# EAGLE design card (EAGLE 8.4.1)
REVISION: 1; SCH_DESC: Standalone Magnetic card reader for Apiary; TEAM: Apiary; TITLE: Apiary Card Reader

## Sheet 1 of 2: Logic
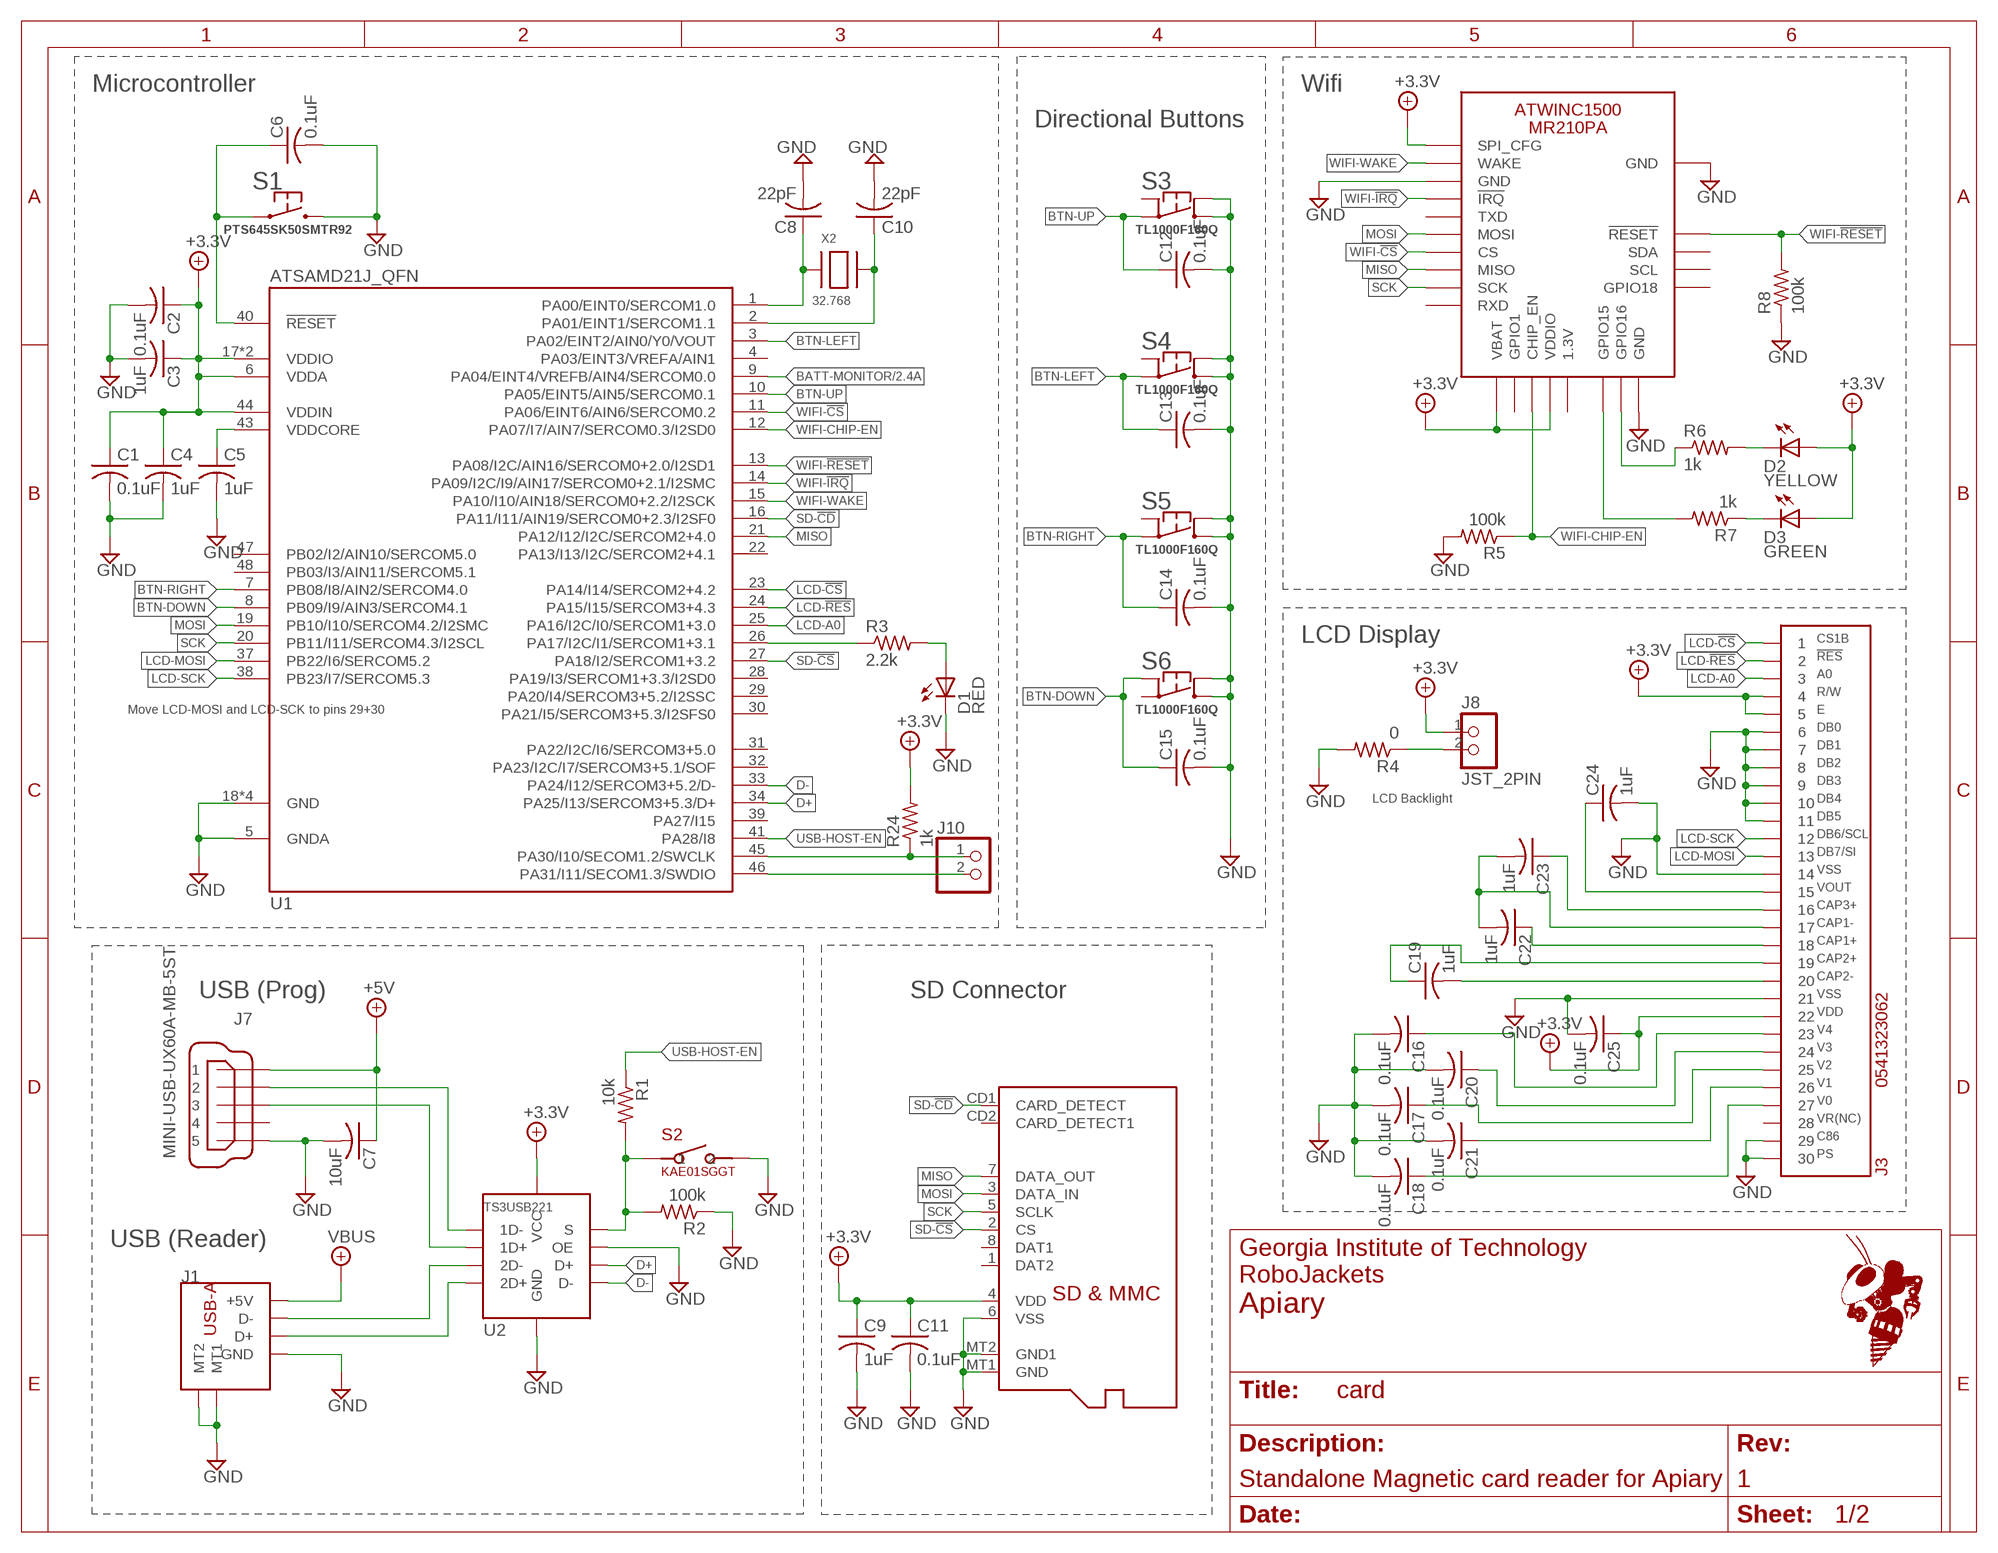
[diagram p0: schematic, sheet 1]

### Parts
C1  0.1uF  C-USC0603  [C0603]
C2  0.1uF  C-USC0603  [C0603]
C3  1uF  C-USC0603  [C0603]
C4  1uF  C-USC0603  [C0603]
C5  1uF  C-USC0603  [C0603]
C6  0.1uF  C-USC0603  [C0603]
C7  10uF  C-USC0603  [C0603]
C8  22pF  C-USC0603  [C0603]
C9  1uF  C-USC0603  [C0603]
C10  22pF  C-USC0603  [C0603]
C11  0.1uF  C-USC0603  [C0603]
C12  0.1uF  C-USC0603  [C0603]
C13  0.1uF  C-USC0603  [C0603]
C14  0.1uF  C-USC0603  [C0603]
C15  0.1uF  C-USC0603  [C0603]
C16  0.1uF  C-USC0603  [C0603]
C17  0.1uF  C-USC0603  [C0603]
C18  0.1uF  C-USC0603  [C0603]
C19  1uF  C-USC0603  [C0603]
C20  0.1uF  C-USC0603  [C0603]
C21  0.1uF  C-USC0603  [C0603]
C22  1uF  C-USC0603  [C0603]
C23  1uF  C-USC0603  [C0603]
C24  1uF  C-USC0603  [C0603]
C25  0.1uF  C-USC0603  [C0603]
D1  RED  LED-SMD-RED  [CHIP-LED0603]
D2  YELLOW  LED-SMD-YELLOW  [CHIP-LED0603]
D3  GREEN  LED-SMD-GREEN  [CHIP-LED0603]
J1  UE27AC54100  [USB-A]
J2  MICROSD  [MICROSD]
J3  0541323062  [0541323062]
J7  MINI-USB-UX60A-MB-5ST  [UX60A-MB-5ST]
J8  JST_2PIN  [JSTPH2]
J10  CONN-2VERT  [1X2]
R1  10k  R-US_R0603  [R0603]
R2  100k  R-US_R0603  [R0603]
R3  2.2k  R-US_R0603  [R0603]
R4  0  R-US_R0603  [R0603]
R5  100k  R-US_R0603  [R0603]
R6  1k  R-US_R0603  [R0603]
R7  1k  R-US_R0603  [R0603]
R8  100k  R-US_R0603  [R0603]
R24  1k  R-US_R0603  [R0603]
S1  PTS645SK50SMTR92  [PTS645SK50SMTR92]
S2  KAE01SGGT  [KAE01SGGT]
S3  TL1000F160Q  [TL1100]
S4  TL1000F160Q  [TL1100]
S5  TL1000F160Q  [TL1100]
S6  TL1000F160Q  [TL1100]
U1  ATSAMD21J_QFN  [TQFN48_7MM]
U2  TS3USB221  [10-PIN-UQFN]
X2  32.768  XTAL-3.2X1.5  [XTAL3215]
X3  ATWINC1500_MR210PA  [ATWINC1500_MR210PA]

### Nets
1D+: J7.3 U2.1(1D+)
1D-: J7.2 U2.2(1D-)
2D+: J1.3(D+) U2.3(2D+)
2D-: J1.2(D-) U2.4(2D-)
!RESET: C6.1 S1.1 S1.2 U1.40(!RESET)
+3.3V: C1.1 C2.1 C3.1 C4.1 C9.1 C11.1 C25.1 D2.A D3.A J2.4(VDD) J3.4 J3.5 J3.22 J8.1 R24.2 U1.6(VDDA) U1.17(VDDIO) U1.36(VDDIO) U1.44(VDDIN) U2.10(VCC) X3.J10(SPI_CFG) X3.J20(VBAT) X3.J23(VDDIO) ; also sheet 2
+5V: C7.1 J7.1 ; also sheet 2
BATT-MONITOR: U1.9(PA04/EINT4/VREFB/AIN4/SERCOM0.0) ; also sheet 2
BTN-DOWN: C15.1 S6.2(1B) U1.8(PB09/I9/AIN3/SERCOM4.1)
BTN-LEFT: C13.1 S4.1(1A) U1.3(PA02/EINT2/AIN0/Y0/VOUT)
BTN-RIGHT: C14.1 S5.1(1A) U1.7(PB08/I8/AIN2/SERCOM4.0)
BTN-UP: C12.1 S3.1(1A) U1.10(PA05/EINT5/AIN5/SERCOM0.1)
D+: U1.34(PA25/I13/SERCOM3+5.3/D+) U2.8(D+)
D-: U1.33(PA24/I12/SERCOM3+5.2/D-) U2.7(D-)
GND: C1.2 C2.2 C3.2 C4.2 C5.2 C6.2 C7.2 C8.2 C9.2 C10.2 C11.2 C12.2 C13.2 C14.2 C15.2 C16.2 C17.2 C18.2 C20.2 C21.2 C24.2 C25.2 D1.C(K) J1.4(GND) J1.MT1 J1.MT2 J2.6(VSS) J2.MT1(GND) J2.MT2(GND1) J3.6 J3.7 J3.8 J3.9 J3.10 J3.11 J3.14 J3.21 J3.29 J3.30 J7.5 R2.1 R4.2 R5.2 R8.1 S1.3 S1.4 S2.2 S3.3(2A) S3.4(2B) S4.3(2A) S4.4(2B) S5.3(2A) S5.4(2B) S6.3(2A) S6.4(2B) U1.5(GNDA) U1.18(GND) U1.35(GND) U1.42(GND) U1.THERMAL(GND) U2.5(GND) U2.6(OE) X3.J9(GND) X3.J12(GND) X3.J28(GND) ; also sheet 2
LCD-!CS: J3.1 U1.23(PA14/I14/SERCOM2+4.2)
LCD-!RES: J3.2 U1.24(PA15/I15/SERCOM3+4.3)
LCD-A0: J3.3 U1.25(PA16/I2C/I0/SERCOM1+3.0)
LCD-CA1+: C22.1 J3.18
LCD-CA1-: C22.2 C23.2 J3.17
LCD-CA2+: C19.1 J3.19
LCD-CA2-: C19.2 J3.20
LCD-CA3+: C23.1 J3.16
LCD-K: J8.2 R4.1
LCD-MOSI: J3.13 U1.37(PB22/I6/SERCOM5.2)
LCD-SCK: J3.12 U1.38(PB23/I7/SERCOM5.3)
LCD-V0: C18.1 J3.27
LCD-V1: C21.1 J3.26
LCD-V2: C17.1 J3.25
LCD-V3: C20.1 J3.24
LCD-V4: C16.1 J3.23
LCD-VOUT: C24.1 J3.15
MISO: J2.7(DATA_OUT) U1.21(PA12/I12/I2C/SERCOM2+4.0) X3.J17(MISO)
MOSI: J2.3(DATA_IN) U1.19(PB10/I10/SERCOM4.2/I2SMC) X3.J15(MOSI)
PROG-LED: D1.A R3.2
PROG-LED-2: R3.1 U1.26(PA17/I2C/I1/SERCOM1+3.1)
SCK: J2.5(SCLK) U1.20(PB11/I11/SERCOM4.3/I2SCL) X3.J18(SCK)
SD-!CD: J2.CD1(CARD_DETECT) U1.16(PA11/I11/AIN19/SERCOM0+2.3/I2SF0)
SD-!CS: J2.2(CS) U1.27(PA18/I2/SERCOM1+3.2)
SWCLK: J10.1 R24.1 U1.45(PA30/I10/SECOM1.2/SWCLK)
SWDIO: J10.2 U1.46(PA31/I11/SECOM1.3/SWDIO)
USB-HOST-EN: R1.1 U1.41(PA28/I8)
USB-S: R1.2 R2.2 S2.1 U2.9(S)
VBUS: J1.1(+5V) ; also sheet 2
VDDCORE: C5.1 U1.43(VDDCORE)
WIFI-!CS: U1.11(PA06/EINT6/AIN6/SERCOM0.2) X3.J16(CS)
WIFI-!IRQ: U1.14(PA09/I2C/I9/AIN17/SERCOM0+2.1/I2SMC) X3.J13(!IRQ)
WIFI-!RESET: R8.2 U1.13(PA08/I2C/AIN16/SERCOM0+2.0/I2SD1) X3.J4(!RESET)
WIFI-CHIP-EN: R5.1 U1.12(PA07/I7/AIN7/SERCOM0.3/I2SD0) X3.J22(CHIP_EN)
WIFI-GPIO15: R7.2 X3.J26(GPIO15)
WIFI-GPIO16: R6.1 X3.J27(GPIO16)
WIFI-LED-G: D3.C(K) R7.1
WIFI-LED-Y: D2.C(K) R6.2
WIFI-WAKE: U1.15(PA10/I10/AIN18/SERCOM0+2.2/I2SCK) X3.J11(WAKE)
X3-1: C8.1 U1.1(PA00/EINT0/SERCOM1.0) X2.P$1
X3-2: C10.1 U1.2(PA01/EINT1/SERCOM1.1) X2.P$2
Unconnected: J2.1(DAT2) J2.8(DAT1) J2.CD2(CARD_DETECT1) J3.28 J7.4 S3.2(1B) S4.2(1B) S5.2(1B) S6.1(1A) U1.4(PA03/EINT3/VREFA/AIN1) U1.22(PA13/I13/I2C/SERCOM2+4.1) U1.28(PA19/I3/SERCOM1+3.3/I2SD0) U1.29(PA20/I4/SERCOM3+5.2/I2SSC) U1.30(PA21/I5/SERCOM3+5.3/I2SFS0) U1.31(PA22/I2C/I6/SERCOM3+5.0) U1.32(PA23/I2C/I7/SERCOM3+5.1/SOF) U1.39(PA27/I15) U1.47(PB02/I2/AIN10/SERCOM5.0) U1.48(PB03/I3/AIN11/SERCOM5.1) X3.J1(GPIO18) X3.J2(SCL) X3.J3(SDA) X3.J14(TXD) X3.J19(RXD) X3.J21(GPIO1) X3.J24(1.3V)

### Notes on the sheet
- Microcontroller | Wifi
- Directional Buttons
- LCD Display | CS1B
- !RES
- A0
- R/W
- Move LCD-MOSI and LCD-SCK to pins 29+30 | E
- DB0
- DB1
- DB2
- DB3
- LCD Backlight | DB4
- DB5
- DB6/SCL
- DB7/SI
- VSS
- VOUT
- CAP3+
- CAP1-
- CAP1+
- CAP2+
- CAP2-
- USB (Prog) | SD Connector | VSS
- VDD
- V4
- V3
- V2
- V1
- V0
- VR(NC)
- C86
- PS
- USB (Reader)

## Sheet 2 of 2: Power
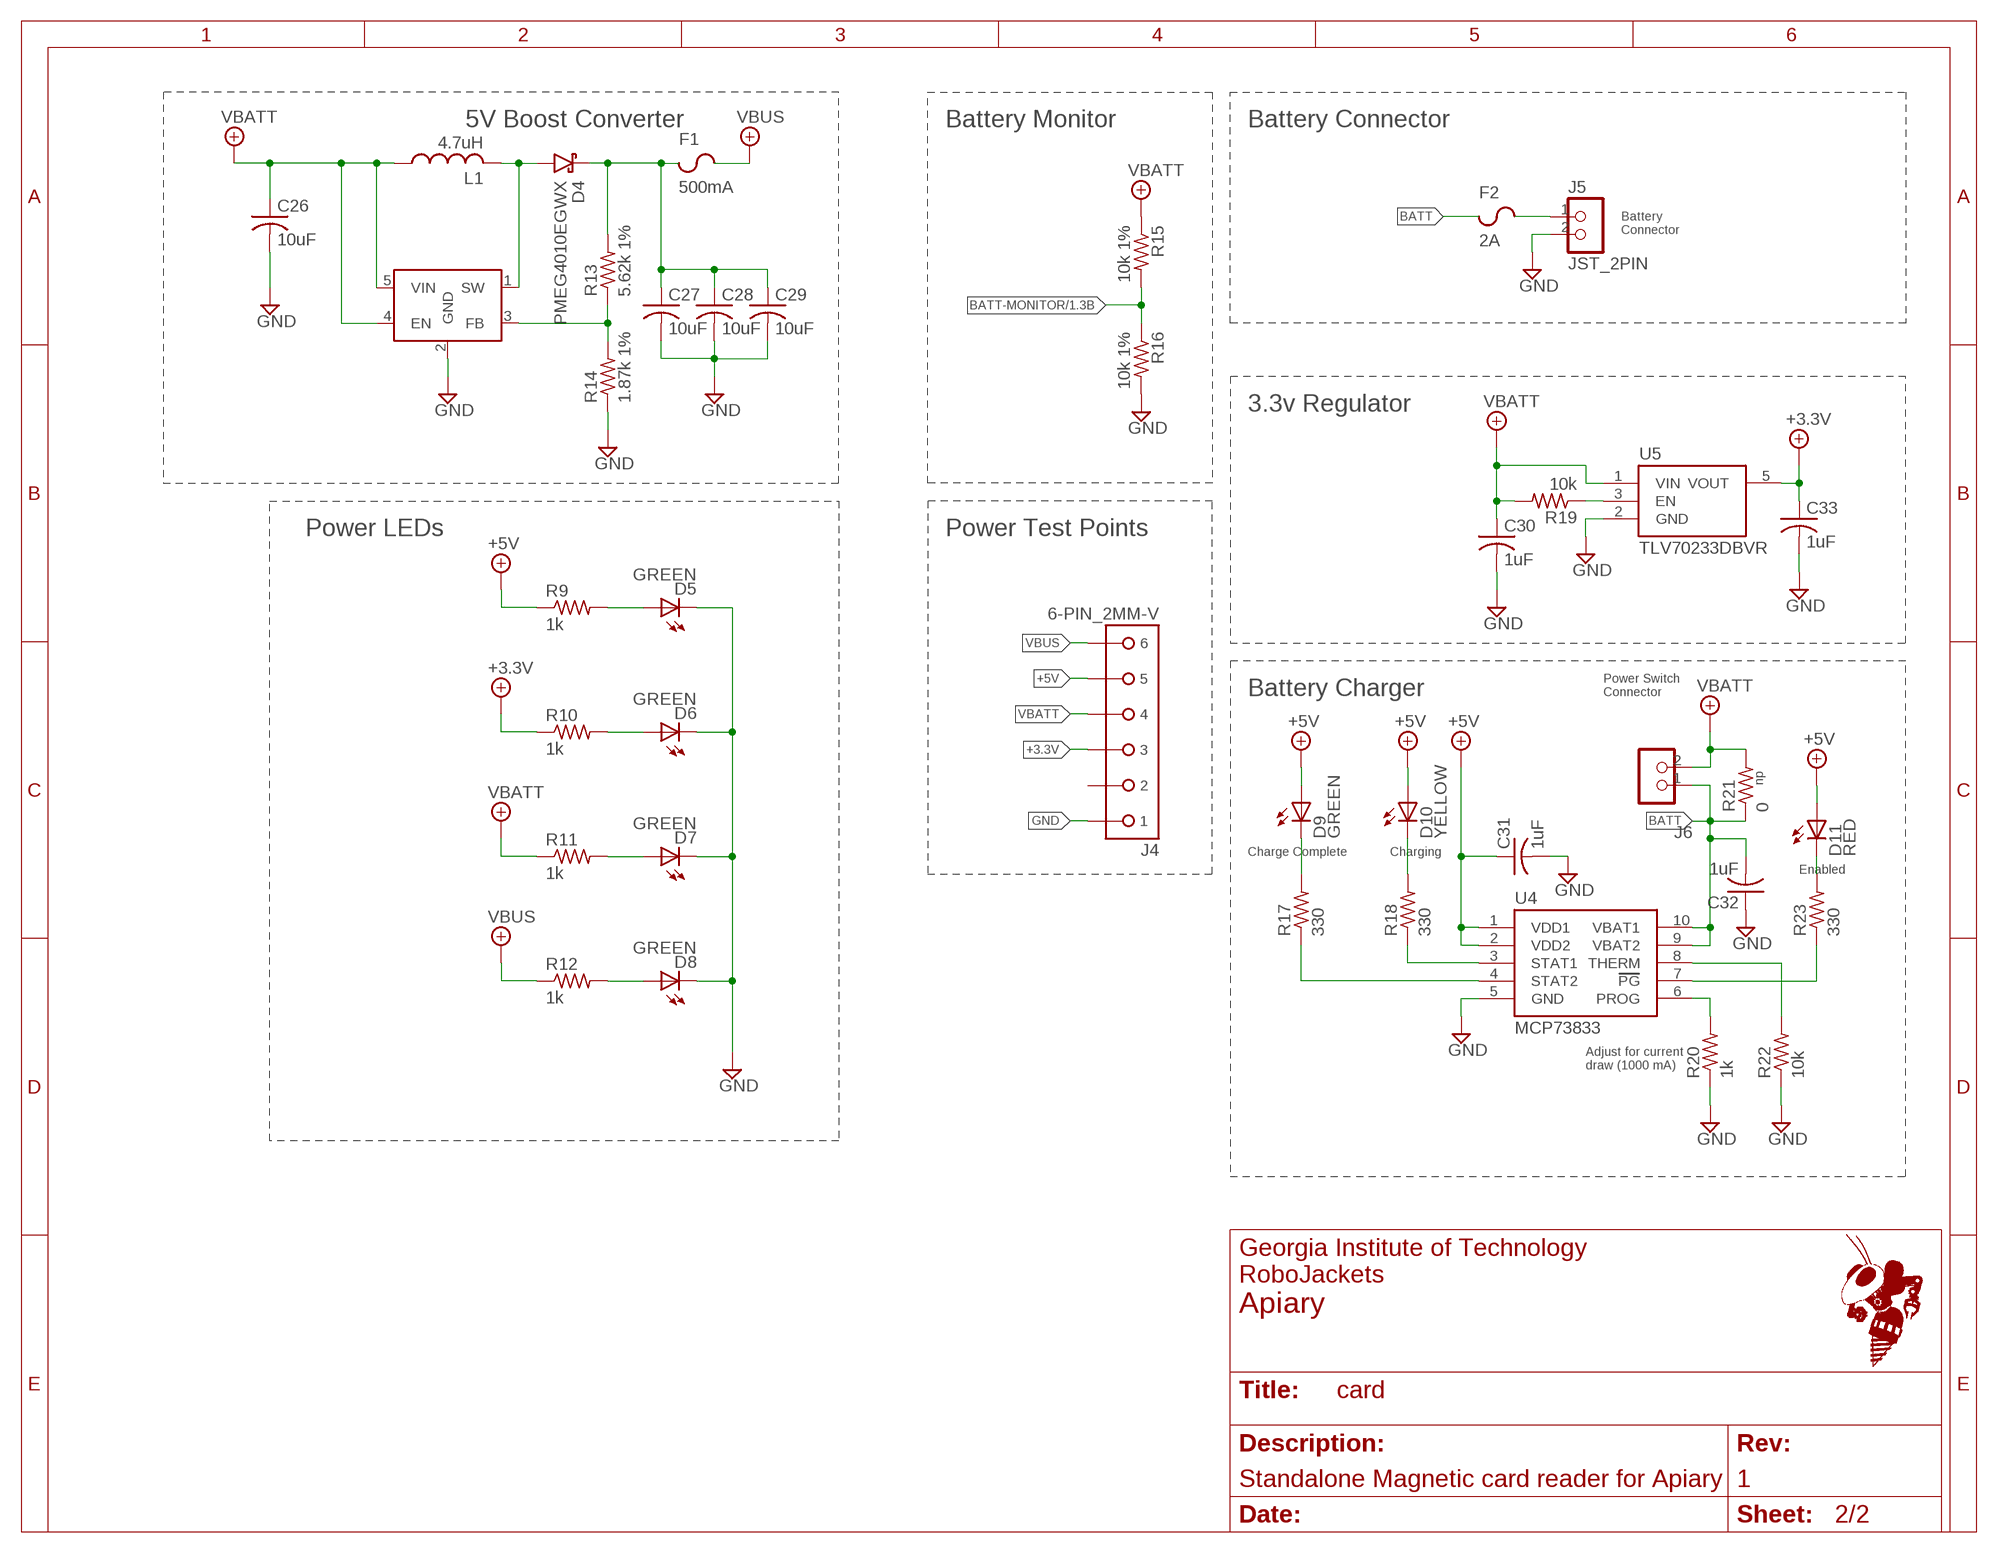
[diagram p1: schematic, sheet 2]

### Parts
C26  10uF  C-USC0603  [C0603]
C27  10uF  C-USC0603  [C0603]
C28  10uF  C-USC0603  [C0603]
C29  10uF  C-USC0603  [C0603]
C30  1uF  C-USC0603  [C0603]
C31  1uF  C-USC0603  [C0603]
C32  1uF  C-USC0603  [C0603]
C33  1uF  C-USC0603  [C0603]
D4  PMEG4010EGWX  SCHOTTKEY-DIODE-SOD123  [SOD123]
D5  GREEN  LED-SMD-GREEN  [CHIP-LED0603]
D6  GREEN  LED-SMD-GREEN  [CHIP-LED0603]
D7  GREEN  LED-SMD-GREEN  [CHIP-LED0603]
D8  GREEN  LED-SMD-GREEN  [CHIP-LED0603]
D9  GREEN  LED-SMD-GREEN  [CHIP-LED0603]
D10  YELLOW  LED-SMD-YELLOW  [CHIP-LED0603]
D11  RED  LED-SMD-RED  [CHIP-LED0603]
F1  500mA  CHIP_FUSE0603  [F0603]
F2  2A  CHIP_FUSE0603  [F0603]
J4  6-PIN_2MM-V  [2MM-6-V]
J5  JST_2PIN  [JSTPH2]
J6  JST_2PIN  [JSTPH2]
L1  4.7uH  L-US-0805  [L0805]
R9  1k  R-US_R0603  [R0603]
R10  1k  R-US_R0603  [R0603]
R11  1k  R-US_R0603  [R0603]
R12  1k  R-US_R0603  [R0603]
R13  5.62k 1%  R-US_R0603  [R0603]
R14  1.87k 1%  R-US_R0603  [R0603]
R15  10k 1%  R-US_R0603  [R0603]
R16  10k 1%  R-US_R0603  [R0603]
R17  330  R-US_R0603  [R0603]
R18  330  R-US_R0603  [R0603]
R19  10k  R-US_R0603  [R0603]
R20  1k  R-US_R0603  [R0603]
R21  0  R-US_R0603  [R0603]
R22  10k  R-US_R0603  [R0603]
R23  330  R-US_R0603  [R0603]
U3  MIC2288YD5-TR  [TSOT-23-5]
U4  MCP73833  [MSOP10]
U5  TLV70233DBVR  [SOT-23-5]

### Nets
3V3_EN: R19.1 U5.3(EN)
+3.3V: C33.1 J4.3 R10.1 U5.5(VOUT) ; also sheet 1
+5V: C31.1 D9.A D10.A D11.A J4.5 R9.1 U4.1(VDD1) U4.2(VDD2) ; also sheet 1
BATT: C32.2 F2.1 J6.1 R21.1 U4.9(VBAT2) U4.10(VBAT1)
BATT-MONITOR: R15.2 R16.1 ; also sheet 1
BATT-PRE-FUSE: F2.2 J5.1
BOOST_FB: R13.1 R14.2 U3.3(FB)
BOOST_OUTPUT: C27.1 C28.1 C29.1 D4.C F1.1 R13.2
BOOST_SW: D4.A L1.2 U3.1(SW)
CHRG-!PG: R23.1 U4.7(PG)
CHRG-PROG: R20.2 U4.6(PROG)
CHRG-STAT1: R18.1 U4.3(STAT1)
CHRG-STAT2: R17.1 U4.4(STAT2)
CHRG-THERM: R22.2 U4.8(THERM)
GND: C26.2 C27.2 C28.2 C29.2 C30.2 C31.2 C32.1 C33.2 D5.C(K) D6.C(K) D7.C(K) D8.C(K) J4.1 J5.2 R14.1 R16.2 R20.1 R22.1 U3.2(GND) U4.5(GND) U5.2(GND) ; also sheet 1
LED-3V3: D6.A R10.2
LED-5V: D8.A R12.2
LED-!PG: D11.C(K) R23.2
LED-STAT1: D10.C(K) R18.2
LED-STAT2: D9.C(K) R17.2
LED-VBATT: D7.A R11.2
LED-VBUS: D5.A R9.2
VBATT: C26.1 C30.1 J4.4 J6.2 L1.1 R11.1 R15.1 R19.2 R21.2 U3.4(EN) U3.5(VIN) U5.1(VIN)
VBUS: F1.2 J4.6 R12.1 ; also sheet 1
Unconnected: J4.2

### Notes on the sheet
- 5V Boost Converter | Battery Monitor | Battery Connector
- Battery
  Connector
- 3.3v Regulator
- Power LEDs | Power Test Points
- Battery Charger
- Power Switch
  Connector
- np
- Charge Complete | Charging
- Enabled
- Adjust for current 
  draw (1000 mA)

## Library data of the parts
C1-C6 C8-C33 = rcl:C-US: CAPACITOR, American symbol
C7 = card:C-US: CAPACITOR, American symbol
D1 D11 = RoboJackets-LEDs:LED-SMD; DIGIKEY: 160-1447-1-ND; MPN: LTST-C191KRKT
D2 D10 = RoboJackets-LEDs:LED-SMD; DIGIKEY: 160-1448-1-ND; MPN: LTST-C191KSKT
D3 D5-D9 = RoboJackets-LEDs:LED-SMD; DIGIKEY: 160-1446-1-ND; MPN: LTST-C191KGKT
D4 = CardReader:SCHOTTKEY-DIODE-
F1 F2 = RoboJackets-Fuses:CHIP_FUSE
J1 = CardReader:UE27AC54100
J2 = CardReader:MICROSD: Micro-SD / Transflash card holder with SPI pinout For the 3M # 2908-05WB-MG and/or 4UCON #19656 push-push type
J3 = CardReader:0541323062: 30 Position FFC, FPC Connector Contacts, Bottom 0.020" (0.50mm) Surface Mount, Right Angle
J4 = RoboJackets-Connectors:6-PIN_2MM-*; PINS: 6; PIN_PITCH: 2.0 mm
J5 J6 = CardReader:JST_2PIN: JST 2-Pin Right-Angle Connector PH-Series - 4UConnector: 17311 SH-Series - 4UConnector: 07278
J7 = lib-card:MINI-USB-: MINI USB Connector Source: http://www.hirose.co.jp/cataloge_hp/e24000019.pdf; OC_FARNELL: unknown; OC_NEWARK: unknown
J8 = card:JST_2PIN: JST 2-Pin Right-Angle Connector PH-Series - 4UConnector: 17311 SH-Series - 4UConnector: 07278
J10 = RoboJackets-Connectors:CONN-2
L1 = CardReader:L-US
R1-R24 = rcl:R-US_: RESISTOR, American symbol
S1 = CardReader:PTS645SK50SMTR92
S2 = CardReader:KAE01SGGT
S3-S6 = CardReader:TL1000F160Q: Tactile Switch SPST-NO Top Actuated Through Hole
U1 = CardReader:ATSAMD21J
U2 = CardReader:TS3USB221: High Speed USB 2.0 1:2 MUX-DEMUX switch with single enable
U3 = CardReader:MIC2288YD5-TR: Boost Switching Regulator IC Positive Adjustable 2.5V 1 Output 1.2A (Switch) SOT-23-5 Thin, TSOT-23-5; MPN: MIC2288YD5-TR
U4 = CardReader:MCP73833: Lithium-Polymer/Lithium-Ion Battery Charger [Part No.] Microchip MCP73833 MSOP10 (tube only): Digikey: MCP73833T-AMI/UN or MCP73833-FCI/UN-ND Mouser: 579-MCP73833-AMI/UN DFN10 (tape): Digikey: Note Chips ending in 'AMI' have no timer, and chips ending in 'FCI' have a 6-hour timer that will end the charge sequence after 6 horus regqrdless of current charge level.
U5 = lib-card:TLV70233; DIGIKEY: 296-32415-1-ND; MPN: TLV70233DBVR
X2 = lib-card:XTAL: Low cost SMT crystals, no capacitors included http://www.ladyada.net/library/eagle
X3 = CardReader:ATWINC1500_MR210PA: ATWINC1500_MR210PA wifi module

## Board
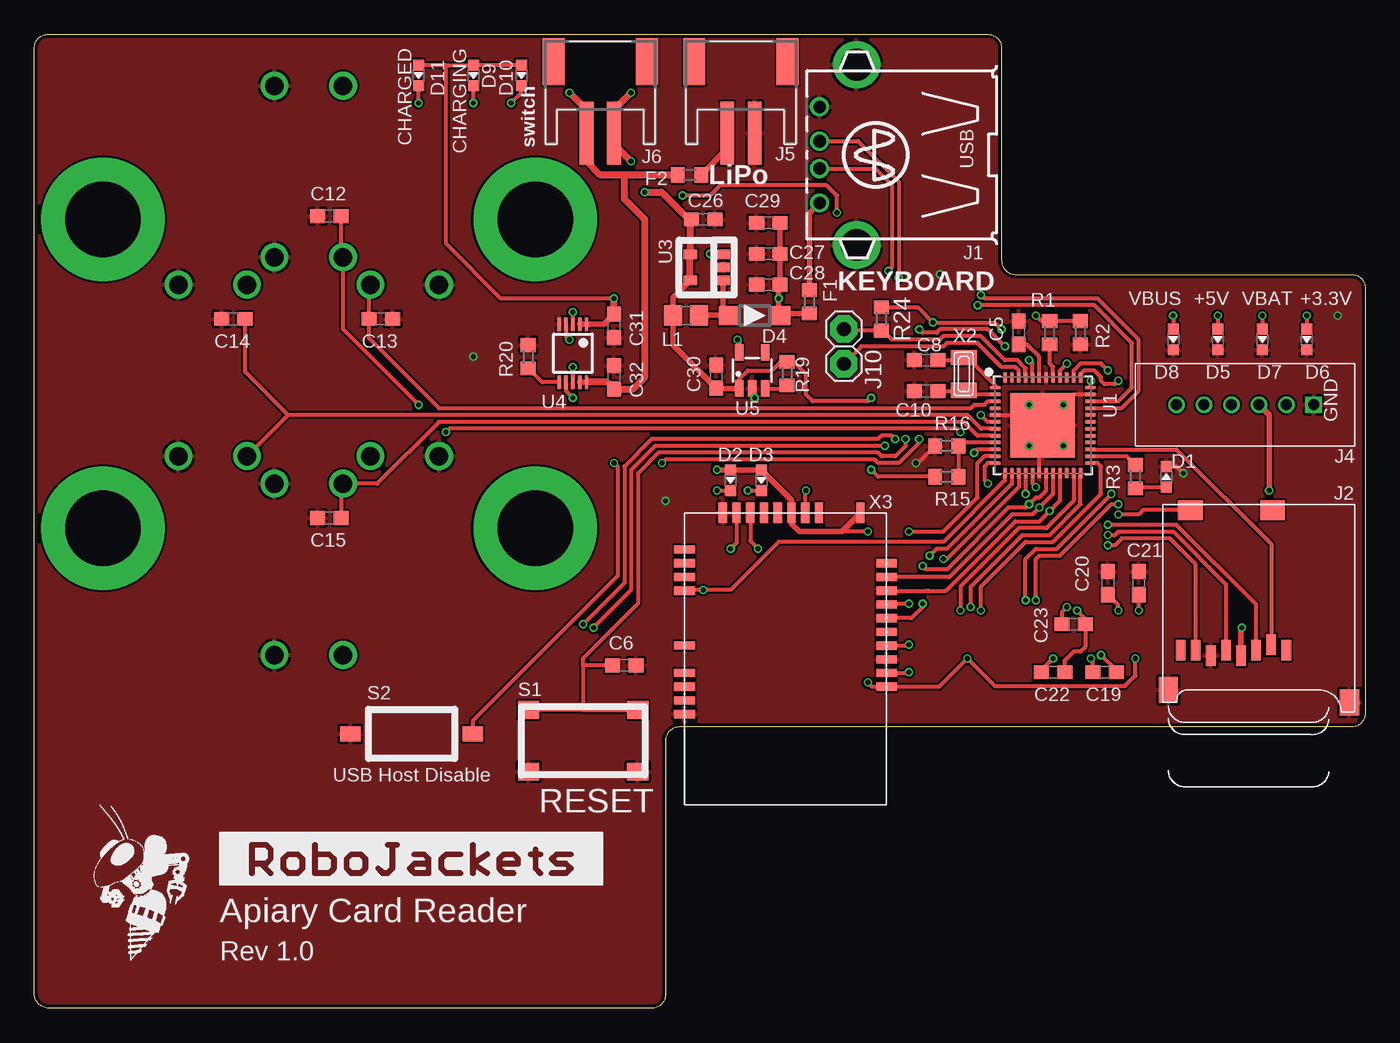
[diagram p2: board, top side]
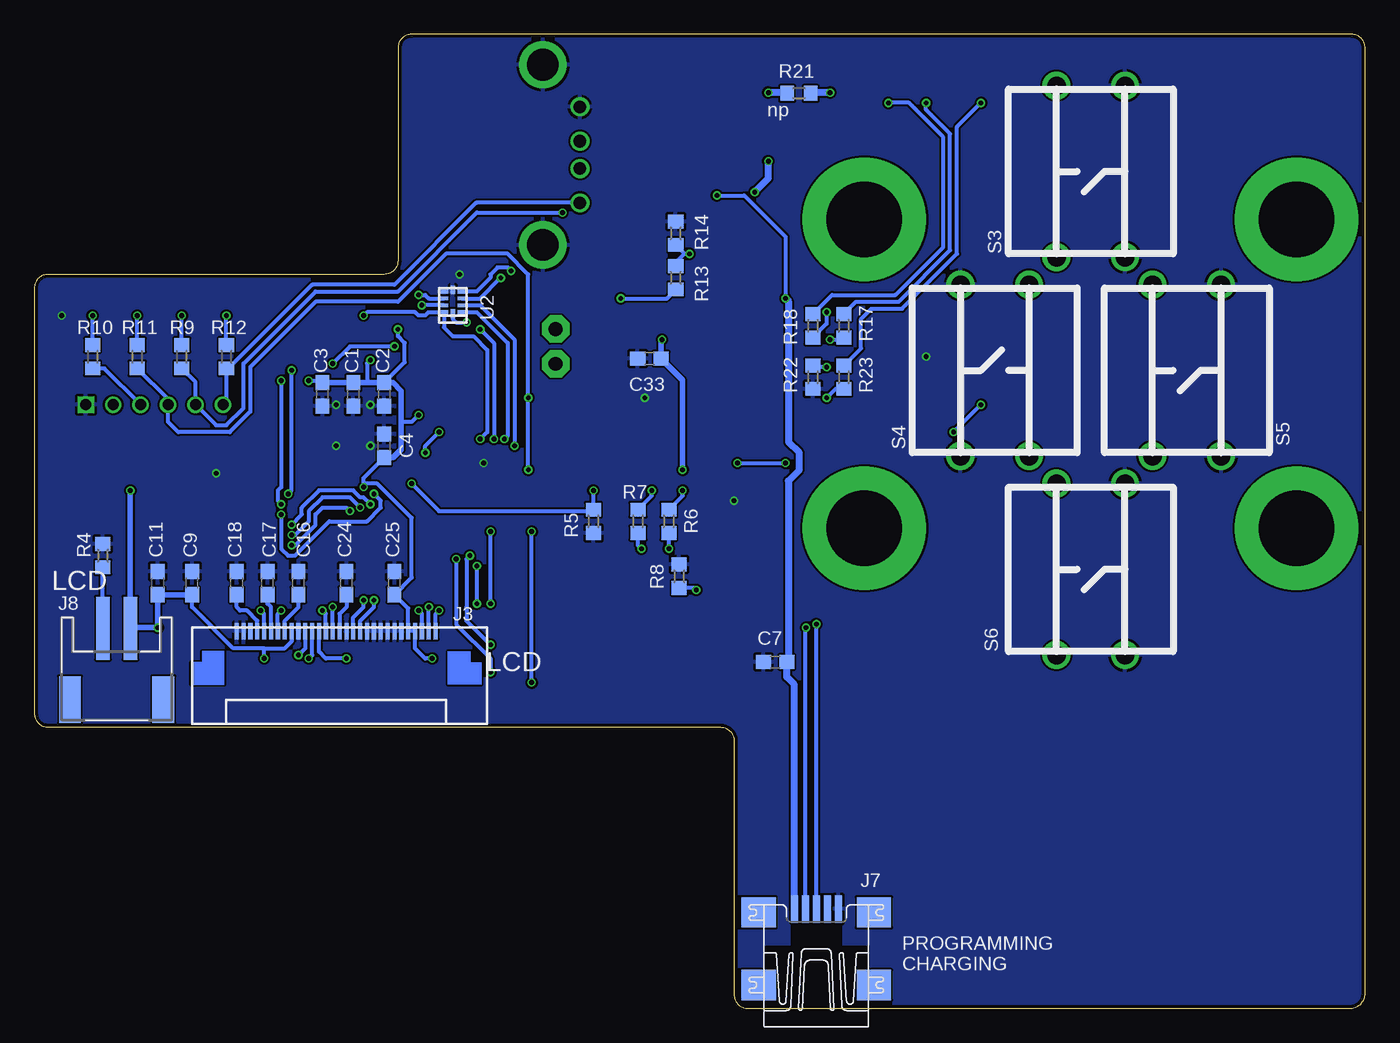
[diagram p3: board, bottom side, seen from below]

Size 97 x 71.01 mm. Coordinates in mm from the lower left corner, seen from the top.
Outline: 97,52.51 97,21.51 arc-90 96,20.51 47,20.51 arc90 46,19.51 46,1.01 arc-90 45,0.01 1.25,0.01 arc-90 0,1.01 0,70.01 arc-90 1,71.01 69.5,71.01 arc-90 70.5,70.01 70.5,54.51 arc90 71.5,53.51 96,53.51 arc-90 97,52.51
Copper layers (1*16): Top 0.018mm / dielectric 1.55mm / Bottom 0.018mm
Design rules "eC_2Layer_PClass6_BaseCopperO18_eCDefault": minimum track width 0.15mm, minimum drill 0.35mm, track to track 0.15mm, track to pad 0.15mm, pad to pad 0.15mm, via to via 0.15mm, smd to smd 0mil, copper to edge 0.25mm, drill to drill 0.35mm, minimum pad ring 0.175mm, minimum via ring 0.125mm, stop-mask expansion 0mil, vias tented up to drill 0.45mm, thermal gap 0.2mm

### Footprints (pad centres in the part's own frame; a part is rotated, then mirrored left to right if it is on the bottom)
C0603 = smd 1.1 x 1: 1 -0.85,0; 2 0.85,0
CHIP-LED0603 = smd 0.8 x 0.8: A 0,-0.75; C 0,0.75
SOD123 = smd 1.4 x 1.4: A 1.9,0; C -1.9,0
F0603 = smd 1 x 1.1: 1 -0.85,0; 2 0.85,0
USB-A = drill 0.92: 1 -3.5,12.99; 2 -1,12.99; 3 1,12.99; 4 3.5,12.99 | drill 2.3: MT1 -6.57,10.3; MT2 6.57,10.3
MICROSD = smd 0.7 x 1.5: 1 9,-10.64; 2 7.9,-10.24; 3 6.8,-10.64; 4 5.7,-11.04; 5 4.6,-10.64; 6 3.5,-11.04; 7 2.4,-10.64; 8 1.3,-10.64 | smd 1.8 x 1.4: CD1 2,-0.44; CD2 8,-0.44 | smd 1.4 x 1.9: MT1 0.4,-13.54; MT2 13.6,-14.44
0541323062 = smd 0.3 x 1.2: 1 7.25,1.5; 2 6.75,1.5; 3 6.25,1.5; 4 5.75,1.5; 5 5.25,1.5; 6 4.75,1.5; 7 4.25,1.5; 8 3.75,1.5; 9 3.25,1.5; 10 2.75,1.5; 11 2.25,1.5; 12 1.75,1.5; 13 1.25,1.5; 14 0.75,1.5; 15 0.25,1.5; 16 -0.25,1.5; 17 -0.75,1.5; 18 -1.25,1.5; 19 -1.75,1.5; 20 -2.25,1.5; 21 -2.75,1.5; 22 -3.25,1.5; 23 -3.75,1.5; 24 -4.25,1.5; 25 -4.75,1.5; 26 -5.25,1.5; 27 -5.75,1.5; 28 -6.25,1.5; 29 -6.75,1.5; 30 -7.25,1.5
2MM-6-V = drill 0.8 square: 1 -4,0 | drill 0.8: 2 -2,0; 3 0,0; 4 2,0; 5 4,0; 6 6,0
JSTPH2 = smd 1 x 4.6: 1 -1,-3.7; 2 1,-3.7 | smd 1.6 x 3.4: NC1 -3.4,1.5; NC2 3.4,1.5
UX60A-MB-5ST = smd 2 x 0.5: 1 2.25,1.6; 2 2.25,0.8; 3 2.25,0; 4 2.25,-0.8; 5 2.25,-1.6 | smd 2.2 x 2.5: M1 -3.3,-4.2; M2 -3.3,4.2; M3 2,4.2; M4 2,-4.2
1X2 = drill 1.016 pad 2 octagon: 1 -1.27,0; 2 1.27,0
L0805 = smd 1.3 x 1.5: 1 -0.95,0; 2 0.95,0
R0603 = smd 1 x 1.1: 1 -0.85,0; 2 0.85,0
PTS645SK50SMTR92 = smd 1.55 x 1.3: 1 -3.975,2.25; 2 3.975,2.25; 3 -3.975,-2.25; 4 3.975,-2.25
KAE01SGGT = smd 1.1 x 1.5: 1 0,-4.45; 2 0,4.45
TL1100 = drill 1.35: 1 -6.25,2.5; 2 6.25,2.5; 3 -6.25,-2.5; 4 6.25,-2.5
TQFN48_7MM = smd 0.25 x 0.75: 1 -2.75,-3.475; 2 -2.25,-3.475; 3 -1.75,-3.475; 4 -1.25,-3.475; 5 -0.75,-3.475; 6 -0.25,-3.475; 7 0.25,-3.475; 8 0.75,-3.475; 9 1.25,-3.475; 10 1.75,-3.475; 11 2.25,-3.475; 12 2.75,-3.475; 25 2.75,3.475; 26 2.25,3.475; 27 1.75,3.475; 28 1.25,3.475; 29 0.75,3.475; 30 0.25,3.475; 31 -0.25,3.475; 32 -0.75,3.475; 33 -1.25,3.475; 34 -1.75,3.475; 35 -2.25,3.475; 36 -2.75,3.475 | smd 0.75 x 0.25: 13 3.475,-2.75; 14 3.475,-2.25; 15 3.475,-1.75; 16 3.475,-1.25; 17 3.475,-0.75; 18 3.475,-0.25; 19 3.475,0.25; 20 3.475,0.75; 21 3.475,1.25; 22 3.475,1.75; 23 3.475,2.25; 24 3.475,2.75; 37 -3.475,2.75; 38 -3.475,2.25; 39 -3.475,1.75; 40 -3.475,1.25; 41 -3.475,0.75; 42 -3.475,0.25; 43 -3.475,-0.25; 44 -3.475,-0.75; 45 -3.475,-1.25; 46 -3.475,-1.75; 47 -3.475,-2.25; 48 -3.475,-2.75 | smd 4.7 x 4.7: THERMAL 0,0
10-PIN-UQFN = smd 0.3 x 0.58: 1 -0.75,-0.635; 4 0.75,-0.635; 6 0.75,0.635; 9 -0.75,0.635 | smd 0.25 x 0.58: 2 -0.25,-0.635; 3 0.25,-0.635; 7 0.25,0.635; 8 -0.25,0.635 | smd 0.63 x 0.35: 5 0.86,0; 10 -0.86,0
TSOT-23-5 = smd 0.7 x 1: 1 0.95,1.2; 2 0,1.2; 3 -0.95,1.2; 4 -0.95,-1.2; 5 0.95,-1.2
MSOP10 = smd 0.25 x 1: 1 -1,-2.113; 2 -0.5,-2.113; 3 0,-2.113; 4 0.5,-2.113; 5 1,-2.113; 6 1,2.113; 7 0.5,2.113; 8 0,2.113; 9 -0.5,2.113; 10 -1,2.113
SOT-23-5 = smd 0.6 x 1.2: 1 -0.95,-1.306; 2 0,-1.306; 3 0.95,-1.306; 4 0.95,1.306; 5 -0.95,1.306
XTAL3215 = smd 1.1 x 1.9: P$1 1.2,0; P$2 -1.2,0
ATWINC1500_MR210PA = smd 1.5 x 0.6: J1 7.11,-4.95; J2 7.11,-3.95; J3 7.11,-2.95; J4 7.11,-1.95; J5 7.11,2.05; J6 7.11,4.05; J7 7.11,5.05; J8 7.11,6.05; J9 7.11,7.05; J10 -7.62,5.06; J11 -7.62,4.06; J12 -7.62,3.06; J13 -7.62,2.06; J14 -7.62,1.06; J15 -7.62,0.06; J16 -7.62,-0.94; J17 -7.62,-1.94; J18 -7.62,-2.94; J19 -7.62,-3.94 | smd 0.6 x 1.5: J20 -5.72,-7.62; J21 -2.68,-7.62; J22 -1.68,-7.62; J23 -0.68,-7.62; J24 0.32,-7.62; J25 1.32,-7.62; J26 2.32,-7.62; J27 3.32,-7.62; J28 4.32,-7.62

### Placement (x,y rotation side)
C1  73.75,44.76 270 bottom
C2  71.5,44.76 270 bottom
C3  76,44.76 270 bottom
C4  71.5,41.01 90 bottom
C5  71.75,49.26 90 top
C6  43,25.01 0 top
C7  43,25.26 180 bottom
C8  65,47.26 180 top
C9  85.5,31.01 90 bottom
C10  65,45.01 180 top
C11  88,31.01 90 bottom
C12  21.5,57.76 180 top
C13  25.25,50.26 0 top
C14  14.5,50.26 180 top
C15  21.5,35.76 180 top
C16  77.75,31.01 90 bottom
C17  80,31.01 90 bottom
C18  82.25,31.01 90 bottom
C19  78,24.51 0 top
C20  78.25,31.01 90 top
C21  80.5,31.01 90 top
C22  74.25,24.51 0 top
C23  75.75,28.01 0 top
C24  74.25,31.01 90 bottom
C25  70.75,31.01 90 bottom
C26  48.75,57.51 0 top
C27  53.5,55.01 180 top
C28  53.5,52.76 180 top
C29  53.5,57.26 180 top
C30  49.7,46.06 90 top
C31  42.25,49.76 270 top
C32  42.25,46.01 270 top
C33  52.17,47.38 180 bottom
D1  82.5,38.76 0 top
D2  50.75,38.51 180 top
D3  53,38.51 180 top
D4  52.5,50.51 180 top
D5  86.25,48.76 180 top
D6  92.75,48.76 180 top
D7  89.5,48.76 180 top
D8  83,48.76 180 top
D9  32,68.01 180 top
D10  35.5,68.01 180 top
D11  28,68.01 180 top
F1  56.5,51.51 90 top
F2  47.75,60.76 0 top
J1  70.23,62.22 90 top
J2  82.25,36.76 0 top
J3  75,26.01 0 bottom
J4  89.25,44.01 180 top
J5  51.5,67.51 0 top
J6  41.25,67.51 0 top
J7  40,5.01 90 bottom
J8  91,24.01 180 bottom
J10  59,48.26 270 top
L1  47.5,50.51 0 top
R1  74,49.26 90 top
R2  76.25,49.26 90 top
R3  80.25,38.76 270 top
R4  92,33.01 90 bottom
R5  56.25,35.51 270 bottom
R6  50.75,35.51 90 bottom
R7  53,35.51 270 bottom
R8  50,31.51 270 bottom
R9  86.25,47.51 90 bottom
R10  92.75,47.51 90 bottom
R11  89.5,47.51 90 bottom
R12  83,47.51 90 bottom
R13  50.25,53.26 270 bottom
R14  50.25,56.51 270 bottom
R15  66.5,38.76 0 top
R16  66.5,41.01 180 top
R17  38,49.76 90 bottom
R18  40.25,49.76 90 bottom
R19  54.87,46.28 90 top
R20  36,47.51 270 top
R21  41.27,66.71 180 bottom
R22  40.25,46.01 90 bottom
R23  38,46.01 90 bottom
R24  61.75,50.26 90 top
S1  40,19.51 0 top
S2  27.5,20.01 90 top
S3  20,61.01 90 bottom
S4  27,46.51 270 bottom
S5  13,46.51 90 bottom
S6  20,32.01 90 bottom
U1  73.5,42.51 270 top
U2  66.5,51.51 90 bottom
U3  49,54.01 270 top
U4  39.25,47.76 180 top
U5  52.32,46.51 0 top
U$1  [ROBOBUZZ_0.6X]  7,3.51 0 top
U$2  [ROBOJACKETS]  13.5,9.01 0 top
X2  67.75,46.26 90 top
X3  54.5,28.51 180 top

### Tracks (layer width: path | path; a pad name or v marks a point on that pad's centre or on a via)
1D+  (via drill 0.35)
  Top 0.3: v62.75,41.51 62.5,41.76 61.75,41.76 61.5,41.51 45,41.51 43,39.51 43,31.01 v40,28.01
  Bottom 0.3: U2.1 64.75,50.76 62.5,48.51 62.5,41.76 v62.75,41.51 | J7.3 v40,28.01
1D-  (via drill 0.35)
  Top 0.3: v40.75,27.76 43.5,30.51 43.5,39.26 45.25,41.01 v62,41.01
  Bottom 0.3: U2.2 64.5,51.26 62,48.76 v62,41.01 | v40.75,27.76 40.8,27.71 J7.2
2D+  (via drill 0.35)
  Top 0.3: v63,53.26 63,60.26 60.04,63.22 J1.3
  Bottom 0.3: U2.3 64.5,51.76 v63,53.26
2D-  (via drill 0.35)
  Top 0.3: J1.2 61.29,61.22 62.5,60.01 62.5,54.01 v62.25,53.76
  Bottom 0.3: v62.25,53.76 62.5,54.01 63.25,54.01 63.75,53.51 63.75,53.26 64.75,52.26 U2.4
3V3_EN
  Top 0.3: U5.3 54.64,45.2 R19.1
!RESET  (via drill 0.35)
  Top 0.3: v70.75,48.26 69.5,49.51 66,49.51 65.75,49.26 64.75,49.26 v64.5,49.51 | v63.5,41.51 63.5,41.01 62.75,40.26 61.75,40.26 61.5,40.51 45.5,40.51 44,39.01 44,29.51 40,25.51 40,25.01 | 40,21.76 S1.1 | 40,21.76 S1.2 | 40,25.01 40,21.76 | C6.1 40,25.01 | U1.40 74.75,46.51 v75.25,47.01
  Bottom 0.3: v64.5,49.51 63.5,48.51 v63.5,41.51 | v70.75,48.26 74,48.26 v75.25,47.01
+3.3V  (via drill 0.35)
  Top 0.3: v60.75,23.76 61.06,23.45 X3.J10 65.94,23.45 v68,25.51 70,23.51 79.5,23.51 80.25,24.26 v80.25,25.51 | v60.75,34.76 58.85,34.76 | v70.5,49.51 70,50.01 v65.5,50.01 64.4,51.11 R24.2 | U1.17 72.75,38.26 v73,38.01 | U1.6 69.5,42.76 v69,43.26 | U1.44 72.75,47.01 v72.5,47.26 | U1.36 76.97,45.73 v77,45.76
  Top 0.4: X3.J20 58.85,34.76 55.75,34.76 55.18,35.33 X3.J23 55.18,37.08 D3.A D2.A v49.75,39.26 | J2.4 87.95,27.71 v88,27.76 | v90,37.76 90,43.26 J4.3 | v51.25,48.76 51.37,48.64 U5.5
  Bottom 0.3: v68,25.51 68.5,25.51 69.25,26.26 J3.4 J3.5 69.75,29.16 C25.1 69.5,31.41 69.5,35.76 72,38.26 73,38.26 | v60.75,23.76 v60.75,34.76 | C2.1 70,47.11 70,48.51 70.5,49.01 v70.5,49.51 | J3.22 78.25,26.76 78.75,26.26 80.25,26.26 | 80.25,26.26 82.5,26.26 85.5,29.26 C9.1 | v80.25,25.51 80.25,26.26 | 73,38.26 v73,38.01 | 73,38.26 73,38.66 C4.1 | v69,43.26 69.5,42.76 70.25,42.76 | v72.5,47.26 72.75,47.01 72.75,45.61 | v77,45.76 76.15,45.76 C3.1 | R10.1 91.9,46.66 J4.3 | U2.10 66.5,50.26 66.25,50.01 v65.5,50.01
  Bottom 0.4: C3.1 C1.1 72.75,45.61 C2.1 70.85,45.61 70.25,45.01 70.25,42.76 70.25,40.76 70.85,40.16 C4.1 | C9.1 C11.1 v88,27.76 89.95,27.76 J8.1 v90,37.76 | v49.75,39.26 49.75,45.81 C33.1 51.32,48.69 v51.25,48.76
+5V  (via drill 0.35)
  Top 0.3: D10.A D9.A 30,68.76 | 30,68.76 D11.A | v42.25,51.76 34,51.76 30,55.76 30,68.76 | v58.5,58.01 58.5,59.26 57.75,60.01 50,60.01 49.25,59.26 v47.25,59.26
  Top 0.4: U4.2 U4.1 41.51,49.87 C31.1
  Top 0.5: C31.1 v42.25,51.76
  Bottom 0.3: v47.25,59.26 45.25,59.26 42.25,56.26 v42.25,51.76 | v58.5,58.01 64.75,58.01 70.5,52.26 76.5,52.26 81.75,47.01 81.75,43.76 83,42.51 83.75,42.51 J4.5 85.25,45.66 R9.1
  Bottom 0.5: J7.1 41.6,23.61 42.15,24.16 C7.1 42.05,25.36 42.05,38.46 41.25,39.26 41.25,40.51 42,41.26 42,51.51 v42.25,51.76
BATT  (via drill 0.35)
  Top 0.3: J6.1 40.25,65.51
  Top 0.4: U4.10 U4.9 | 43,59.01 43.02,59.03
  Top 0.5: U4.10 41.76,45.64 C32.2 43.65,45.16 44.5,46.01 44.5,57.51 43,59.01 | F2.1 43.02,60.76 | 43.02,59.03 43.02,60.76 | 40.25,65.51 v39,66.76 | 43.02,60.76 41.25,60.76 40.25,61.76 J6.1
  Bottom 0.3: 40.37,66.76 R21.1
  Bottom 0.5: v39,66.76 40.37,66.76
BATT-MONITOR
  Top 0.3: R15.2 R16.1 67.6,41.26 U1.9
BATT-PRE-FUSE
  Top 0.4: F2.2 50.5,62.66 J5.1
BOOST_FB  (via drill 0.35)
  Top 0.3: U3.3 49.3,54.96 v49.25,55.01
  Bottom 0.3: 49.6,55.01 v49.25,55.01 | 49.6,55.01 R14.2 | R13.1 50.25,54.36 49.6,55.01
BOOST_OUTPUT  (via drill 0.35)
  Top 0.4: C29.1 C27.1 C28.1 54.25,52.66 v54.25,51.76 54.25,50.66 D4.C 54.55,50.66 F1.1
  Bottom 0.3: v54.25,51.76 50.9,51.76 R13.2
BOOST_SW
  Top 0.4: 50.55,50.56 D4.A | 50.55,50.56 50.2,50.91 U3.1 | L1.2 48.5,50.56 50.55,50.56
BTN-DOWN
  Top 0.3: U1.8 68.75,41.76 67.75,42.76 29.5,42.76 25,38.26 S6.2 22.35,38.11 C15.1
BTN-LEFT
  Top 0.3: S4.1 24.4,52.66 C13.1 24.4,48.86 29.5,43.76 68.25,43.76 68.5,44.01 69.25,44.01 69.5,44.26 U1.3
BTN-RIGHT
  Top 0.3: U1.7 69,42.26 68,43.26 18.5,43.26 | S5.1 18.5,43.26 | 18.5,43.26 15.35,46.41 C14.1
BTN-UP  (via drill 0.35)
  Top 0.3: U1.10 68.75,40.76 v68.5,40.51 | v67.5,42.01 67.25,42.26 30.25,42.26 v30,42.01 | v28,44.01 22.5,49.51 S3.1 22.35,54.91 C12.1
  Bottom 0.3: v68.5,40.51 68.5,41.01 v67.5,42.01 | v30,42.01 v28,44.01
CHRG-!PG  (via drill 0.35)
  Top 0.3: U4.7 38.75,45.01 v39.25,44.51
  Bottom 0.3: v39.25,44.51 38.6,45.16 R23.1
CHRG-PROG
  Top 0.3: U4.6 37.01,45.64 R20.2
CHRG-STAT1  (via drill 0.35)
  Top 0.3: U4.3 v39.25,50.76
  Bottom 0.3: v39.25,50.76 39.25,49.91 R18.1
CHRG-STAT2  (via drill 0.35)
  Top 0.3: U4.4 38.75,49.01 v39,48.76
  Bottom 0.3: v39,48.76 38.15,48.76 R17.1
CHRG-THERM  (via drill 0.35)
  Top 0.3: U4.8 v39.25,46.76
  Bottom 0.3: v39.25,46.76 40.15,46.76 R22.2
D+  (via drill 0.35)
  Top 0.3: U1.34 79,44.26 80,45.26 80,48.51 77.25,51.26 v68.75,51.26
  Bottom 0.3: U2.8 v68.75,51.26
D-  (via drill 0.35)
  Top 0.3: U1.33 79.25,43.76 80.5,45.01 80.5,48.76 77.5,51.76 69.25,51.76 v69,52.01
  Bottom 0.3: v69,52.01 68.5,52.01 68.25,51.76 U2.7
GND  (via drill 0.35)
  Top 0.3: U1.5 71.25,43.26 71.5,43.01 | U1.18 73.25,40.26 73.5,40.51 | U1.35 75.75,44.76 75.5,44.51 | U1.THERMAL 73.5,41.01 v72.5,41.01 | 52.32,45.58 U5.2 52.32,44.69 v52.5,44.51 | R16.2 64.4,39.76 v64.25,39.76 | D1.C 83.25,39.51 v83.75,39.01
  other vias: 72.5,44.01 75,44.01 75,41.01 66,53.51 95,50.51 32,47.51 46,37.01
  pour Bottom: 0,0.01 0,71.01 70.5,71.01 70.5,53.51 97,53.51 97,20.51 46,20.51 46,0.01
  pour Top: 0,0.01 0,71.01 70.5,71.01 70.5,53.51 97,53.51 97,20.51 46,20.51 46,0.01
LCD-!CS  (via drill 0.35)
  Top 0.3: U1.23 75.75,37.01 73.75,35.01 71.75,35.01 67.5,30.76 v67.5,29.01
  Bottom 0.3: J3.1 67.75,28.76 v67.5,29.01
LCD-!RES  (via drill 0.35)
  Top 0.3: v68.25,29.26 68.25,30.76 72,34.51 74,34.51 76.25,36.76 U1.24
  Bottom 0.3: J3.2 v68.25,29.26
LCD-A0  (via drill 0.35)
  Top 0.3: U1.25 77.5,39.76 77.75,39.51 77.75,37.51 74.25,34.01 72.25,34.01 69,30.76 v69,29.01
  Bottom 0.3: J3.3 68.75,28.76 v69,29.01
LCD-CA1+  (via drill 0.35)
  Top 0.3: C22.1 73.4,24.66 v74.25,25.51
  Bottom 0.3: v74.25,25.51 75.75,25.51 76.25,26.01 J3.18
LCD-CA1-  (via drill 0.35)
  Top 0.3: v76,29.01 76.6,28.41 C23.2 76.6,26.36 76.25,26.01 75.75,26.01 75.1,25.36 C22.2
  Bottom 0.3: J3.17 75.75,28.76 v76,29.01
LCD-CA2+  (via drill 0.35)
  Top 0.3: C19.1 77.15,25.36 v77,25.51
  Bottom 0.3: v77,25.51 76.75,25.76 J3.19
LCD-CA2-  (via drill 0.35)
  Top 0.3: v77.75,25.76 78.85,24.66 C19.2
  Bottom 0.3: J3.20 77.25,26.26 v77.75,25.76
LCD-CA3+  (via drill 0.35)
  Top 0.3: v75.25,29.26 74.9,28.91 C23.1
  Bottom 0.3: J3.16 v75.25,29.26
LCD-K
  Bottom 0.3: J8.2 R4.1
LCD-MOSI  (via drill 0.35)
  Top 0.3: U1.37 76.25,46.26 76.5,46.51 77.25,46.51 77.75,46.01 77.75,45.76 78,45.51 78.75,45.51 v79,45.76 | v73,29.76 73,32.76 73.25,33.01 74.75,33.01 78.5,36.76 v79,36.76
  Bottom 0.3: J3.13 73.75,28.51 73,29.26 v73,29.76 | v79,45.76 79,38.01 79.25,37.76 79.25,37.01 v79,36.76
LCD-SCK  (via drill 0.35)
  Top 0.3: U1.38 75.75,46.51 76.25,47.01 77.75,47.01 v78.25,46.51 | v72.25,29.76 72.25,32.76 73,33.51 74.5,33.51 v78.5,37.51
  Bottom 0.3: J3.12 73.25,28.26 72.25,29.26 v72.25,29.76 | v78.5,37.51 78.25,37.76 v78.25,46.51
LCD-V0
  Bottom 0.3: J3.27 80.75,28.26 81.5,29.01 82,29.01 82.25,29.26 C18.1
LCD-V1  (via drill 0.35)
  Top 0.3: v80.5,29.01 C21.1
  Bottom 0.3: J3.26 80.25,28.76 v80.5,29.01
LCD-V2
  Bottom 0.3: J3.25 79.75,29.26 80,29.51 C17.1
LCD-V3  (via drill 0.35)
  Top 0.3: v79,29.01 79,29.41 C20.1
  Bottom 0.3: J3.24 79.25,28.76 v79,29.01
LCD-V4
  Bottom 0.3: J3.23 78.75,28.26 77.75,29.26 C16.1
LCD-VOUT
  Bottom 0.3: C24.1 74.25,29.26 74.75,28.76 J3.15
LED-3V3  (via drill 0.35)
  Top 0.3: v92.75,50.51 D6.A
  Bottom 0.3: R10.2 v92.75,50.51
LED-5V  (via drill 0.35)
  Top 0.3: v83,50.51 D8.A
  Bottom 0.3: R12.2 v83,50.51
LED-!PG  (via drill 0.35)
  Top 0.3: v28,66.01 D11.C
  Bottom 0.3: R23.2 36.75,48.11 36.75,50.26 36,51.01 33.75,51.01 29.75,55.01 29.75,64.26 v28,66.01
LED-STAT1  (via drill 0.35)
  Top 0.3: v34.75,66.01 35.5,66.76 D10.C
  Bottom 0.3: R18.2 38.85,52.01 34.25,52.01 30.75,55.51 30.75,63.51 33.25,66.01 v34.75,66.01
LED-STAT2  (via drill 0.35)
  Top 0.3: v32,66.01 D9.C
  Bottom 0.3: R17.2 37.1,51.51 34,51.51 30.25,55.26 30.25,63.76 32,65.51 v32,66.01
LED-VBATT  (via drill 0.35)
  Top 0.3: v89.5,50.51 D7.A
  Bottom 0.3: R11.2 v89.5,50.51
LED-VBUS  (via drill 0.35)
  Top 0.3: v86.25,50.51 D5.A
  Bottom 0.3: R9.2 v86.25,50.51
MISO  (via drill 0.35)
  Top 0.3: X3.J17 65,30.45 | 65,30.45 65.19,30.45 | J2.7 84.65,32.36 82.75,34.26 79.25,34.26 78.75,33.76 v78.25,33.76 | U1.21 74.75,37.01 v74,36.26 73.25,35.51 71.5,35.51 66.44,30.45 65,30.45
  Bottom 0.3: v78.25,33.76 78,33.76 76.5,35.26 76.5,36.01 76,36.51 74.25,36.51 v74,36.26
MOSI  (via drill 0.35)
  Top 0.3: X3.J15 63.94,28.45 64.75,29.26 v64.75,29.51 | J2.3 89.05,29.46 83.25,35.26 v78.25,35.26 | v64.75,32.26 65,32.01 66.5,32.01 71,36.51 72.25,36.51 v72.5,36.76 73,37.26 73.25,37.26 73.75,37.76 U1.19
  Bottom 0.3: v78.25,35.26 77.5,36.01 77.5,36.51 76.25,37.76 73.75,37.76 73.25,37.26 73,37.26 v72.5,36.76 | v64.75,32.26 v64.75,29.51
N$1  (via drill 5.5 pad 9)
  other vias: 36.5,57.51
N$2  (via drill 5.5 pad 9)
  other vias: 5,57.51
N$3  (via drill 5.5 pad 9)
  other vias: 5,35.01
N$4  (via drill 5.5 pad 9)
  other vias: 36.5,35.01
PROG-LED
  Top 0.3: R3.2 80.35,38.01 D1.A
PROG-LED-2
  Top 0.3: U1.26 78.5,40.26 | 78.5,40.26 78.6,40.26 | 78.5,40.26 79.6,40.26 R3.1
SCK  (via drill 0.35)
  Top 0.3: J2.5 86.85,30.91 83,34.76 79,34.76 78.75,34.51 v78.25,34.51 | U1.20 74.25,37.51 v73.25,36.51 72.75,36.01 71.25,36.01 66.69,31.45 X3.J18
  Bottom 0.3: v73.25,36.51 74,37.26 76,37.26 77,36.26 77,35.51 78,34.51 v78.25,34.51
SD-!CD  (via drill 0.35)
  Top 0.3: v79,36.01 80.5,36.01 80.81,36.32 J2.CD1 | U1.16 v72.25,37.51
  Bottom 0.3: v79,36.01 79,33.51 78.5,33.01 78,33.01 75.5,35.51 72.75,35.51 71.75,36.51 71.75,37.01 v72.25,37.51
SD-!CS
  Top 0.3: J2.2 90.15,33.86 83.25,40.76 U1.27
SWCLK
  Top 0.3: U1.45 72.25,46.66 71.65,47.26 70.75,47.26 69,49.01 66.25,49.01 66,48.76 62.5,48.76 61.85,49.41 R24.1 59.12,49.41 J10.1
SWDIO
  Top 0.3: U1.46 71.75,46.51 71.5,46.76 70.5,46.76 68.75,48.51 66.5,48.51 66.25,48.26 60.27,48.26 J10.2
USB-HOST-EN
  Top 0.3: U1.41 74.25,46.76 74,47.01 R1.1
USB-S  (via drill 0.35)
  Top 0.3: R2.2 R1.2 73.4,50.11 v73,50.51 | v64.5,41.51 64.5,41.26 63,39.76 61.5,39.76 61.25,40.01 46,40.01 v45.75,39.76 | v42.25,39.76 42.5,39.51 42.5,31.51 31.95,20.96 S2.1
  Bottom 0.3: v73,50.51 72.75,50.76 69.25,50.76 69,50.51 68.5,50.51 68.25,50.76 U2.9 67.14,49.64 66.5,49.01 65,49.01 64,48.01 64,42.01 v64.5,41.51 | v45.75,39.76 v42.25,39.76
VBATT  (via drill 0.35)
  Top 0.3: R15.1 61.5,38.76 v61,39.26 | v61,44.51 60.75,44.26 56.75,44.26 56.25,44.76 56.25,46.26 55.38,47.13 R19.2 54.37,47.13 53.75,46.51 52,46.51 51.37,45.88 U5.1 | 42.25,65.51 42.25,64.51 J6.2
  Top 0.4: U3.5 46.55,51.81 L1.1 46.55,48.36 C30.1 49.96,45.2 U5.1 | 47.8,57.41 C26.1
  Top 0.5: U3.5 U3.4 47.8,57.41 45.7,59.51 v44.5,59.51 | v43.5,66.76 42.25,65.51 | v43.5,61.76 42.25,63.01 42.25,64.51
  Bottom 0.3: v61,39.26 v61,44.51 61,53.51 62.5,55.01 67,55.01 70.5,51.51 76.5,51.51 81.25,46.76 81.25,43.51 82.75,42.01 86.5,42.01 87.25,42.76 J4.4 87.25,44.41 R11.1 | R21.2 42.17,66.76
  Bottom 0.4: 44.48,59.53 v44.5,59.51
  Bottom 0.5: 42.17,66.76 v43.5,66.76 | v44.5,59.51 43.5,60.51 v43.5,61.76
VBUS
  Top 0.4: F1.2 56.5,57.98 J1.1
  Bottom 0.3: J4.6 83,44.26 83,46.51 | 83,46.51 R12.1 | J1.1 64.79,58.72 70.75,52.76 76.75,52.76 83,46.51
VDDCORE
  Top 0.3: U1.43 73.25,47.51 72.35,48.41 C5.1
WIFI-!CS  (via drill 0.35)
  Top 0.3: U1.11 69.25,40.26 68.75,39.76 68.75,37.26 66.25,34.76 v63.75,34.76 | X3.J16 62.18,29.51 v63.75,29.51
  Bottom 0.3: v63.75,29.51 v63.75,34.76
WIFI-!IRQ  (via drill 0.35)
  Top 0.3: U1.14 71.25,38.26 66.5,33.51 65.75,33.51 v65.25,33.01 | X3.J13 63.69,26.45 v63.75,26.51
  Bottom 0.3: v65.25,33.01 65.5,32.76 65.5,29.26 65.5,28.26 v63.75,26.51
WIFI-!RESET  (via drill 0.35)
  Top 0.3: U1.13 70.75,38.51 66.25,34.01 54.25,34.01 50.75,30.51 v48.75,30.51 47.44,30.51 X3.J4
  Bottom 0.3: v48.75,30.51 48.9,30.66 R8.2
WIFI-CHIP-EN  (via drill 0.35)
  Top 0.3: U1.12 69.5,39.76 69.25,39.51 69.25,38.51 v69.5,38.26 | v56.25,37.76 56.18,37.69 X3.J22
  Bottom 0.3: v69.5,38.26 67.5,36.26 56.35,36.26 R5.1 v56.25,37.76
WIFI-GPIO15  (via drill 0.35)
  Top 0.3: X3.J26 52.18,34.08 v52.75,33.51
  Bottom 0.3: v52.75,33.51 53,33.76 R7.2
WIFI-GPIO16  (via drill 0.35)
  Top 0.3: X3.J27 51.18,33.94 v50.75,33.51
  Bottom 0.3: v50.75,33.51 R6.1
WIFI-LED-G  (via drill 0.35)
  Top 0.3: v52,37.76 D3.C
  Bottom 0.3: R7.1 52,37.36 v52,37.76
WIFI-LED-Y  (via drill 0.35)
  Top 0.3: v49.75,37.76 D2.C
  Bottom 0.3: R6.2 49.75,37.36 v49.75,37.76
WIFI-WAKE  (via drill 0.35)
  Top 0.3: U1.15 71.75,38.01 66.5,32.76 v66.25,32.76 | X3.J11 63.69,24.45 v63.75,24.51
  Bottom 0.3: v66.25,32.76 66.25,28.01 63.75,25.51 v63.75,24.51
X3-1
  Top 0.3: C8.1 67.8,47.26 X2.P$1 68,47.46 70.03,45.43 U1.1
X3-2
  Top 0.3: C10.1 67.8,45.01 X2.P$2 68.05,44.76 U1.2

### Text on the board
tPlace: CHARGED | CHARGING | switch | LiPo | KEYBOARD | VBUS | +5V | VBAT | +3.3V | GND | RESET | Apiary Card Reader | Rev 1.0
bPlace: np | LCD | LCD | PROGRAMMING / CHARGING
tNames: USB Host Disable
bNames: U2